# Altium project PCB_Project1.PrjPCB
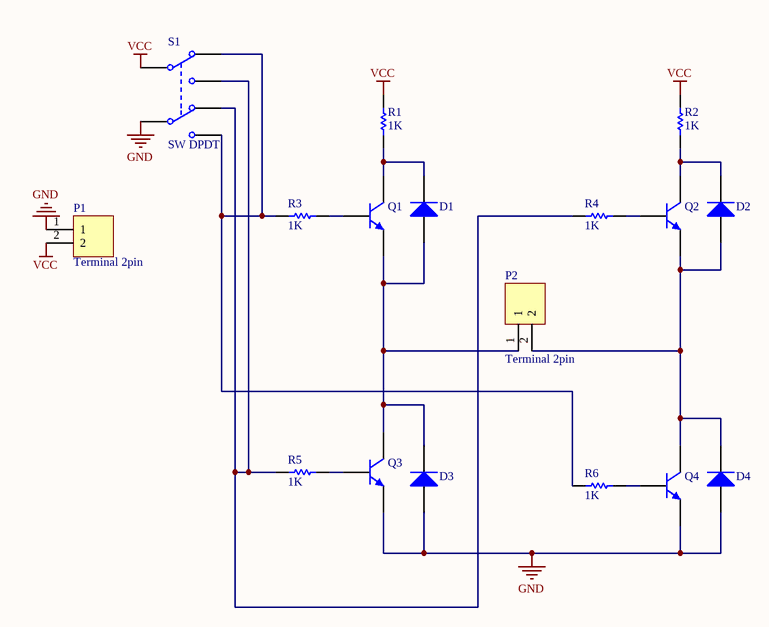
[diagram p0: Sheet1.SchDoc]
1 sheet, 17 parts. Net scope: global (net labels, ports and power ports of the same name join across sheets).
Board file: PCB1.PcbDoc

## Sheet Sheet1.SchDoc
size A

### Parts
D1  1N4007  [DO-41]  (value not drawn)
D2  1N4007  [DO-41]  (value not drawn)
D3  1N4007  [DO-41]  (value not drawn)
D4  1N4007  [DO-41]  (value not drawn)
P1  Terminal 2pin  [Terminal 2pin]
P2  Terminal 2pin  [Terminal 2pin]
Q1  2N2222A  [TO-18]  (value not drawn)
Q2  2N2222A  [TO-18]  (value not drawn)
Q3  2N2222A  [TO-18]  (value not drawn)
Q4  2N2222A  [TO-18]  (value not drawn)
R1  1K  [Axial-0.4-0.25W]
R2  1K  [Axial-0.4-0.25W]
R3  1K  [Axial-0.4-0.25W]
R4  1K  [Axial-0.4-0.25W]
R5  1K  [Axial-0.4-0.25W]
R6  1K  [Axial-0.4-0.25W]
S1  SW DPDT  [SOT23-6_N]

### Nets
GND: D3.1(A) D4.1(A) P1.1 Q3.3(E) Q4.3(E) S1.5(COMMON2)
VCC: P1.2 R1.2 R2.2 S1.1(COMMON1)
NetD1_1: D1.1(A) D3.2(K) P2.1 Q1.3(E) Q3.2(C)
NetD1_2: D1.2(K) Q1.2(C) R1.1
NetD2_1: D2.1(A) D4.2(K) P2.2 Q2.3(E) Q4.2(C)
NetD2_2: D2.2(K) Q2.2(C) R2.1
NetQ1_1: Q1.1(B) R3.1
NetQ2_1: Q2.1(B) R4.1
NetQ3_1: Q3.1(B) R5.1
NetQ4_1: Q4.1(B) R6.1
NetR3_2: R3.2 R6.2 S1.2(NC1) S1.6(NO2)
NetR4_2: R4.2 R5.2 S1.3(NO1) S1.4(NC2)

### Library data of the parts
D1-D4 = 1N4007: 1 Amp Diode
Q1-Q4 = 2N2222A: High Speed Switches; Published: 8-Jun-2000; LatestRevisionDate: 11-Dec-2002; LatestRevisionNote: Sim Port Map correction; DatasheetVersion: Jun-1999; PackageReference: TO-18; Publisher: Altium Limited; PackageDescription: Can; 3 Leads; Pin Circle Dia. 2.54 mm; Lead Dia. 0.49 mm (max); ComponentLink1Description: Manufacturer Link; ComponentLink1URL: http://www.st.com/; ComponentLink2Description: Datasheet; ComponentLink2URL: http://www.st.com/stonline/products/literature/ds/9288/2n2219a.pdf
R1-R6 = RES
S1 = SW DPDT: Switch; Published: 24-Mar-1999; LatestRevisionDate: 29-May-2009; LatestRevisionNote: IPC-7351 Footprint Added.; PackageVersion: Mar-2001; PackageReference: SOT23-6; Publisher: Altium Limited; PackageDescription: 6-Pin SOT-23 Package 0.95 mm Pitch, 2.7 mm Lead Span; Code_JEITA: SC-74; Code_IPC: SOT26A-6